# EAGLE design OSO-SAFE-B1-03 (EAGLE 9.4.2)
COMPANY: ADAFRUIT INDUSTRIES; DRAWN: KTOWN; REV: B
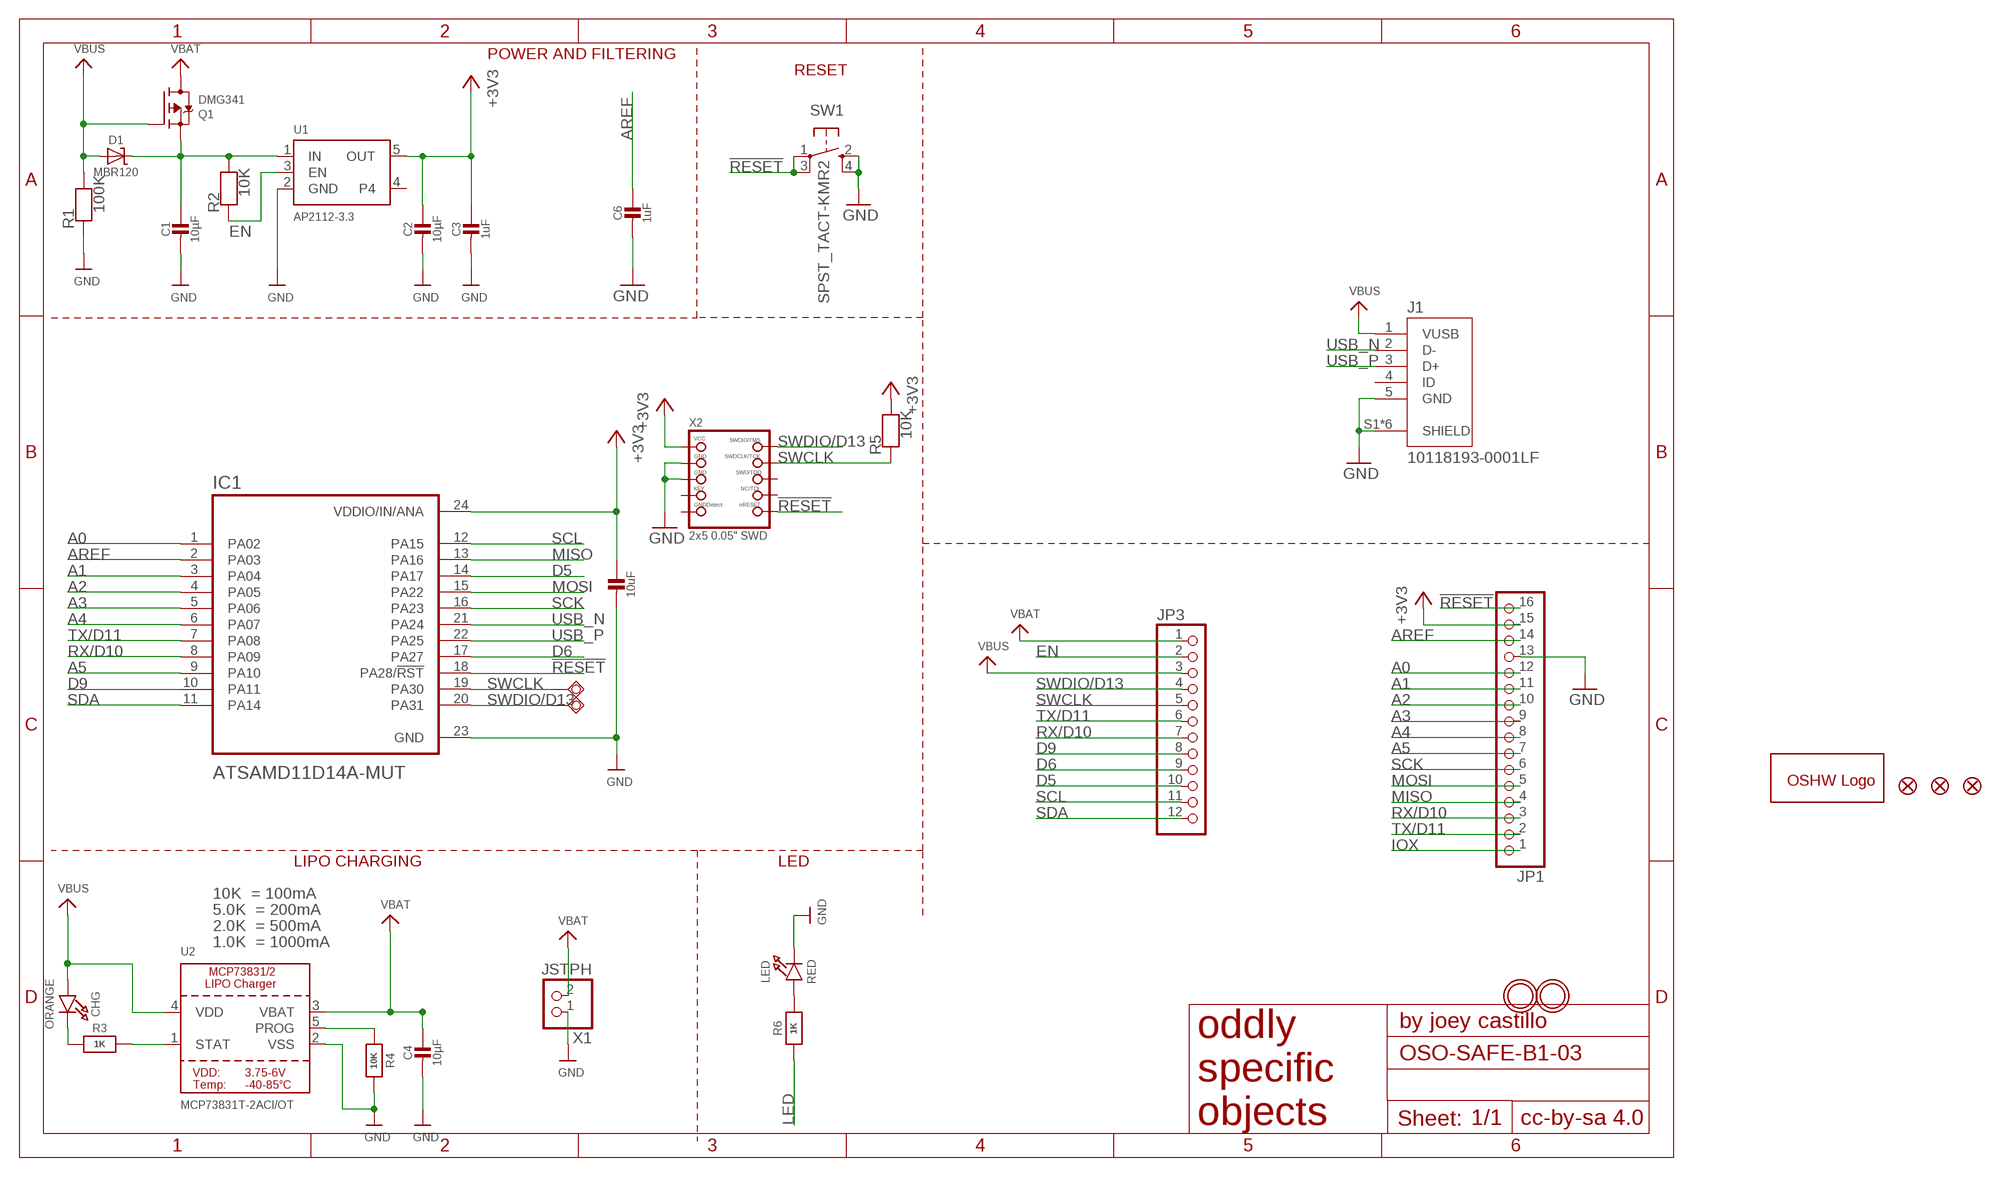
[diagram p0: schematic, sheet 1]

## Parts
C1  10µF  CAP_CERAMIC0805-NOOUTLINE  [0805-NO]
C2  10µF  CAP_CERAMIC0805-NOOUTLINE  [0805-NO]
C3  1uF  CAP_CERAMIC0805-NOOUTLINE  [0805-NO]
C4  10µF  CAP_CERAMIC0805-NOOUTLINE  [0805-NO]
C5  10uF  CAP_CERAMIC0805-NOOUTLINE  [0805-NO]
C6  1uF  CAP_CERAMIC0805-NOOUTLINE  [0805-NO]
CHG  ORANGE  LED0805_NOOUTLINE  [CHIPLED_0805_NOOUTLINE]
D1  MBR120  DIODE-SCHOTTKYSOD-123  [SOD-123]
FID1  FIDUCIAL_1MM  [FIDUCIAL_1MM]
FID3  FIDUCIAL_1MM  [FIDUCIAL_1MM]
FID4  FIDUCIAL_1MM  [FIDUCIAL_1MM]
GOLD_ORB_SM1  OSHWLOGOLOGO5MM  [OSHW_5MM]
IC1  ATSAMD11D14A-MUT  [QFN50P400X400X90-25N]
J1  10118193-0001LF  [FCI_10118193-0001LF]
JP1  HEADER-1X16_MIN  [1X16_ROUND_MIN]
JP3  HEADER-1X12_MIN  [1X12_ROUND_MIN]
LED  RED  LED0805_NOOUTLINE  [CHIPLED_0805_NOOUTLINE]
Q1  DMG341  MOSFET-P  [SOT23-R]
R1  100K  RESISTOR0805_NOOUTLINE  [0805-NO]
R2  10K  RESISTOR0805_NOOUTLINE  [0805-NO]
R3  1K  RESISTOR0805_NOOUTLINE  [0805-NO]
R4  10K  RESISTOR0805_NOOUTLINE  [0805-NO]
R5  10K  RESISTOR0805_NOOUTLINE  [0805-NO]
R6  1K  RESISTOR0805_NOOUTLINE  [0805-NO]
SW1  SPST_TACT-KMR2  [KMR2]
SWCLK  TPSQTP20R  [TP20R]
SWDIO  TPSQTP20R  [TP20R]
U1  AP2112-3.3  VREG_SOT23-5  [SOT23-5]
U2  MCP73831T-2ACI/OT  MCP73831/2  [SOT23-5]
U$31  MOUNTINGHOLE2.5  [MOUNTINGHOLE_2.5_PLATED]
U$32  MOUNTINGHOLE2.5  [MOUNTINGHOLE_2.5_PLATED]
X1  JSTPH  CON_JST_PH_2PIN  [JSTPH2]
X2  2x5 0.05" SWD  JTAG-CORTEXBOXPOSTS  [2X05_1.27MM_BOX_POSTS]

## Nets
!RESET: IC1.18(PA28/!RST) JP1.16 SW1.1(P) SW1.3(P1) X2.10(NRESET)
+3V3 [power]: C2.1 C3.1 C5.1 IC1.24(VDDIO/IN/ANA) JP1.15 R5.2 U1.5(OUT) X2.1(VCC)
A0: IC1.1(PA02) JP1.12
A1: IC1.3(PA04) JP1.11
A2: IC1.4(PA05) JP1.10
A3: IC1.5(PA06) JP1.9
A4: IC1.6(PA07) JP1.8
A5: IC1.9(PA10) JP1.7
AREF: C6.1 IC1.2(PA03) JP1.14
CHG: CHG.C R3.1
D5: IC1.14(PA17) JP3.10
D6: IC1.17(PA27) JP3.9
D9: IC1.10(PA11) JP3.8
EN: JP3.2 R2.1 U1.3(EN)
GND [gnd]: C1.2 C2.2 C3.2 C4.2 C5.2 C6.2 IC1.23(GND) J1.5(GND) J1.S1(SHIELD) J1.S2(SHIELD) J1.S3(SHIELD) J1.S4(SHIELD) J1.S5(SHIELD) J1.S6(SHIELD) JP1.13 LED.C R1.1 R4.2 SW1.2(S) SW1.4(S1) U1.2(GND) U2.2(VSS) X1.1 X2.3(GND) X2.5(GND)
IOX: JP1.1
LED: R6.1
MISO: IC1.13(PA16) JP1.4
MOSI: IC1.15(PA22) JP1.5
N$1: LED.A R6.2
PROG: R4.1 U2.5(PROG)
RX/D10: IC1.8(PA09) JP1.3 JP3.7
SCK: IC1.16(PA23) JP1.6
SCL: IC1.12(PA15) JP3.11
SDA: IC1.11(PA14) JP3.12
STAT: R3.2 U2.1(STAT)
SWCLK: IC1.19(PA30) JP3.5 R5.1 SWCLK.TP X2.4(SWDCLK)
SWDIO/D13: IC1.20(PA31) JP3.4 SWDIO.TP X2.2(SWDIO)
TX/D11: IC1.7(PA08) JP1.2 JP3.6
USB_N: IC1.21(PA24) J1.2(D-)
USB_P: IC1.22(PA25) J1.3(D+)
VBAT [power]: C4.1 JP3.1 Q1.3(D) U2.3(VBAT) X1.2
VBUS [power]: CHG.A D1.A J1.1(VUSB) JP3.3 Q1.1(G) R1.2 U2.4(VDD)
VHI [power]: C1.1 D1.C Q1.2(S) R2.2 U1.1(IN)
Unconnected: J1.4(ID) U1.4 X2.6(SWO) X2.7(KEY) X2.8(TDI) X2.9(GNDDETECT)

## Notes on the sheet
- POWER AND FILTERING
- RESET
- LIPO CHARGING | LED
- 10K  = 100mA
- 5.0K  = 200mA
- 2.0K  = 500mA
- 1.0K  = 1000mA

## Library data of the parts
C1-C6 = microbuilder:CAP_CERAMIC: Ceramic Capacitors For new designs, use the packages preceded by an '_' character since they are more reliable: The following footprints should be used on most boards: _0402 - Standard footprint for regular board layouts _0603 - Standard footprint for regular board layouts _0805 - Standard footprint for regular board layouts _1206 - Standard footprint for regular board layouts For extremely tight-pitch boards where space is at a premium, the following 'micro-pitch' footprints can be used (smaller pads, no silkscreen outline, etc.): _0402MP - Micro-pitch footprint for very dense/compact boards _0603MP - Micro-pitch footprint for very dense/compact boards _0805MP - Micro-pitch footprint for very dense/compact boards _1206MP - Micro-pitch footprint for very dense/compact boards
CHG LED = microbuilder:LED: LED 0603 - 0603 Surface Mount Package 2mA: Green LED - Low Power (3.9mcd, 2ma, 1.7Vf) - Digikey: 475-2709-2-ND Orange LED - Low Power (9.8mcd, 2ma, 1.8Vf) - Digikey: 475-1194-2-ND Red LED - Low Power (5mcd, 2ma, 1.8Vf) - Digikey: 475-1195-2-ND Yellow LED - Low Power (7mcd, 2ma, 1.8Vf) - Digikey: 475-1196-2-ND 5mA: Blue LED - Low Power (17mcd, 5ma, 2.9Vf) - Digikey: LNJ937W8CRACT-ND 0805 - 0805 Surface Mount Package 2mA: Red LED (8.8mcd, 2mA, 1.8Vf, Clear) - Low Power [Digikey: 475-2510-1-ND] Green LED (5mcd, 2mA, 1.8Vf, Clear) - Low Power [Digikey: 475-2730-1-ND] Yellow LED (11.3mcd, 2mA, 1.8Vf, Clear) - Low Power [Digikey: 475-2555-1-ND] 20mA: Red LED (104mcd, 20mA, Diffused) - LS R976 [Digikey: 475-1278-6-ND] Red LED (12mcd, 20mA, 2.0Vf, Clear) - APT2012EC [Digikey: 754-1128-1-ND] Green LED (15mcd, 20mA, 2.2Vf, Clear) - APT2012GC [Digikey: 754-1131-1-ND] Orange LED (160mcd, 20mA, 2.1Vf, Clear) - APT2012SECK [Digikey: 754-1130-1-ND] 1206 - 1206 Surface Mount Package Green LED (26mcd, 20mA, Diffused) - LG N971 [Digikey: 475-1407-6-ND] Red LED (15mcd, 20mA, Diffused) - LH N974 [Digikey: 475-1416-6-ND] Cree - Cree High-Power Surface Mount LEDs XPEBWT-L1-0000-00D50 - White 111lm 350mA 2.9Vf 6200K 110° XTEAWT-00-0000-00000LEE3 - White 114lm 350mA 2.85Vf 5000K 115° Everlight - Everlight 45-21 Series Surface Mount LEDs 45-21/QK2C-B2832AC2CB2/2T - Warm White 2000mcd 20mA 3.25Vf 3050K 120° 45-21/LK2C-B38452C4CB2/2T - Nuetral White 2000mcd 20mA 3.25Vf 4150K 120° 45-21/LK2C-B50634C6CB2/2T - Cold White 2200mcd 20mA 3.25Vf 5650K 120° PLCC2 Reverse Mount LS T77K-J1L2-1-0-2-R18-Z - Red 11.25mcd 2mA 1.8Vf 630nm 120° LO T77K-L1M2-24-Z - Orange 19.6mcd 2mA 1.8Vf 606nm 120° LY T77K-K2M1-26-Z - Yellow 15.7mcd 2mA 1.8Vf 587nm 120°
D1 = microbuilder:DIODE-SCHOTTKY
FID1 FID3 FID4 = microbuilder:FIDUCIAL: Fiducial Alignment Points Various fiducial points for machine vision alignment.; BOM: EXCLUDE
GOLD_ORB_SM1 = oshw:OSHWLOGO: The OSHW logo for PCB layout
IC1 = ATSAMD11D14A-MUT:ATSAMD11D14A-MUT: None; AVAILABILITY: Unavailable; DESCRIPTION: Cortex-M0+, 16KB FLASH, 4KB SRAM, USB - 24 QFN, INDUSTRIAL, GREEN, 1.6-3.6V, 48MHz/ QFN _ZA_; MF: Microchip; MP: ATSAMD11D14A-MUT; PACKAGE: QFN-24 Microchip; PRICE: None
J1 = 10118193-0001LF:10118193-0001LF: Micro USB B Type Receptacle; DESCRIPTION: Single Port 5 Contact Shielded SMT MICRO USB B-Type Receptacle; DIGI-KEY_PART_NUMBER: 609-4616-1-ND; DIGI-KEY_PURCHASE_URL: https://www.digikey.com/product-detail/en/amphenol-icc-fci/10118193-0001LF/609-4616-1-ND/2785380?utm_source=snapeda&utm_medium=aggregator&utm_campaign=symbol; MF: Amphenol ICC; MP: 10118193-0001LF; PACKAGE: None
JP1 = microbuilder:HEADER-1X16: PIN HEADER
JP3 = microbuilder:HEADER-1X12
Q1 = microbuilder:MOSFET-P: P-Channel Mosfet LEGEND VDS: Voltage Drain-Source ID: Drain Current RDS(ON): Drain-Source On-State Resistance VGS(TH): Gate-Source Threshold Voltage CISS: Drain-Source Input Capacitance SOT-23 Name VDS ID RDS(ON) VGS(TH) CISS Order Number IRLML5103 30V 760mA 600 mOhm -- 75pF @ 25V Digikey: IRLML5103PBFCT-ND IRLML6401 12V 4.3A 50 mOhm 950mV @ 250µA 830pF @ 10V Digikey: IRLML6401PBFTR-ND NTR0202PL 20V 400mA 800 mOhm 2.3V @ 250uA 70pF @ 5V Digikey: NTR0202PLT1GOSTR-ND NTR4101PT1G 20V 1.8A 85 mOhm 1.2V @ 250uA 675pF @ 10V Digikey: NTR4101PT1GOSCT-ND DMP2004K 20V 600mA 900 mOhm 1V @ 250uA 175pF @ 16V Digikey: DMP2004KDICT-ND PMV65XP 20V 3.9A 76 mOhm 950mV @ 1mA 725pF @ 20V Digikey: 568-2358-2-ND TO-252 Name VDS ID RDS(ON) VGS(TH) CISS Order Number AOD417 30V 25A 34 mOhm 3V @ 250µA 920pF @ 15V Digikey: 785-1106-2-ND PowerPak Name VDS ID RDS(ON) VGS(TH) CISS Order Number AON7401 30V 12A 14 mOhm 3V @ 250µA 2600pF @ 15V Digikey: 785-1302-1-ND
R1-R6 = microbuilder:RESISTOR: Resistors For new designs, use the packages preceded by an '_' character since they are more reliable: The following footprints should be used on most boards: _0402 - Standard footprint for regular board layouts _0603 - Standard footprint for regular board layouts _0805 - Standard footprint for regular board layouts _1206 - Standard footprint for regular board layouts For extremely tight-pitch boards where space is at a premium, the following 'micro-pitch' footprints can be used (smaller pads, no silkscreen outline, etc.): _0402MP - Micro-pitch footprint for very dense/compact boards _0603MP - Micro-pitch footprint for very dense/compact boards _0805MP - Micro-pitch footprint for very dense/compact boards _1206MP - Micro-pitch footprint for very dense/compact boards
SW1 = adafruit:SPST_TACT: SMT 6mm switch, EVQQ2 series http://www.ladyada.net/library/eagle
SWCLK SWDIO = testpad:TPSQ: Test pad
U1 = microbuilder:VREG_SOT23-5: SOT23-5 Fixed Voltage Regulators Part Current Out V Out V In V Dropout θJA (°C/W) TJ (°C) Digikey Part No. ADP121 150mA 3.3V 3.4-5.5V 0.09V @ 150mA -- -- ADP121-AUJZ33R7CT-ND ADP121 150mA 3.0V 3.1-5.5V 0.09V @ 150mA -- -- ADP121-AUJZ30R7CT-ND ADP122 300mA 3.3V 3.4-5.5V 0.085V @ 300mA -- -- ADP122AUJZ-3.3-R7CT-ND ADP1712 300mA 3.3V 3.5-5.5V 0.17V @ 300mA -- -- ADP1712AUJZ-3.3-R7TR-ND AP7311 (Low Cost) 150mA 3.3V 3.5-6V 0.15V @ 150mA -- -- AP7311-33WG-7DICT-ND LD39015M18R 150mA 1.8V 1.9V-5.5V 0.08V @ 100mA -- -- 497-6977-1-ND LP2985A-33DBVR 150mA 3.3V 3.3-16V 0.28V @ 150mA 206 150 296-18479-1-ND MCP1824T-3302E/OT 300mA 3.3V 3.5V-6V 0.2V @ 300mA -- -- MCP1824T-3302E/OTCT-ND MIC5205-2.5YM5 TR 150mA 2.5V 2.7-16V 0.165V @ 150mA -- -- 576-1257-2-ND MIC5205-3.0YM5 TR 150mA 3.0V 3.2V-16V 0.165V @ 150mA -- -- 576-1258-2-ND MIC5205-3.3YM5 TR 150mA 3.3V 3.5V-16V 0.165V @ 150mA -- -- 576-1259-2-ND TPS780330220 150mA 3.3V+2.2V 3.6-5.5V 250mV Max -- -- 296-23332-1-ND TDA3663/N1,135 100mA 3.3V 3.5-45V 0.18V @ 50mA -- -- 568-5343-1-ND Max operating temp can be calculated using θJA, TJ (max junction temperature), and power in watts. Set the "Maximum Ambient Temperature" until it reaches TJ ("Max Junction Temperature"), which is the absolute limit for safe use of the regulator: Heat Sink Temperature Calculator <http://www.daycounter.com/Calculators/Heat-Sink-Temperature-Calculator.phtml> For example, With 12V source into a 3.3V LP2985 and a 30mA load, we are dissipating (12V-3.3V) * 0.03A = 0.261W. With a θJA of 206 °C/W, a TJ of 150°C, and 261mW we can safely use the chip without a heat sink up to 75°C (=147.1°C Junction Temperature).
U2 = microbuilder:MCP73831/2: MCP73831/2 LIPO Charger VDD: 3.75 - 6V Temp -40 - 85°C Programmable Charge Rate: 15-500mA NOTE: STAT is a tri-state logic output on the MCP73831 and an open-drain output on the MCP73832. SOT23-5 with 4.2V output and tri-state logic on STAT = MCP73831T-2ACI/OT
U$31 U$32 = microbuilder:MOUNTINGHOLE: Mounting Hole For #2 screws (0.086"/2.18mm width, 0.094"/2.4mm hole) use 2.5mm; BOM: EXCLUDE
X1 = microbuilder:CON_JST_PH_2PIN: JST 2-Pin Right-Angle Connector PH-Series - 4UConnector: 17311 SH-Series - 4UConnector: 07278
X2 = microbuilder:JTAG-CORTEX: Serial Wire (SW-DP) Connector Standard 0.05" 10-pin connector is for use with the Cortex M and Cortex A SWD (serial wire debugger) interface (SW-DP) Connectors 2x05_1.27MM_SMT - Inexpensive surface-mount header with bare pins, compatible with standard 10-pin SWD cables (4UCON: 16846) 2x05_1.27MM_BOX_NOPOSTS - Polarised surface-mount box (4UCON with caps: 19735, without caps: 15117 2x05_1.27MM_BOX_POSTS - Polarised surface-mount box with mounting holes (4UCON: 20317) Pinout: http://infocenter.arm.com/help/topic/com.arm.doc.faqs/attached/13634/cortex_debug_connectors.pdf http://www.keil.com/peripherals/coresight/connectors.asp

## Net classes
0 default: width 0.254 mm, drill 0.254 mm
1 power: width 0.305 mm, drill 0.305 mm
2 gnd: width 0.254 mm, drill 0.254 mm

## Board
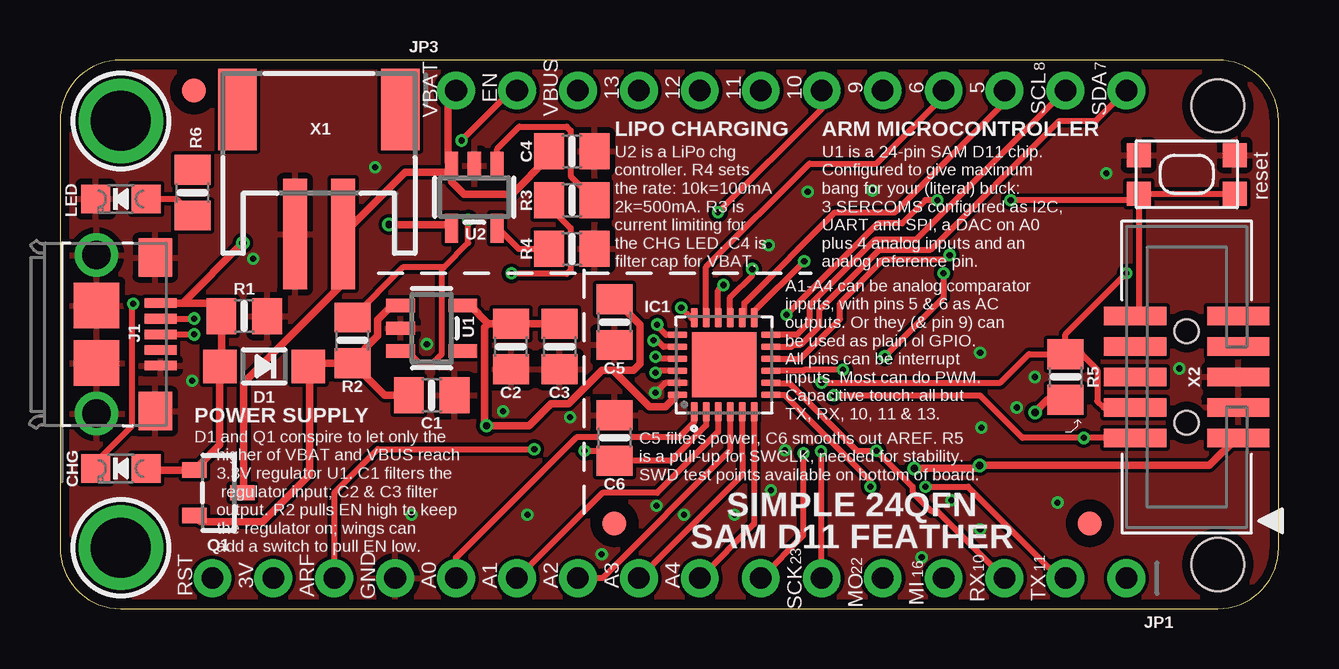
[diagram p1: board, top side]
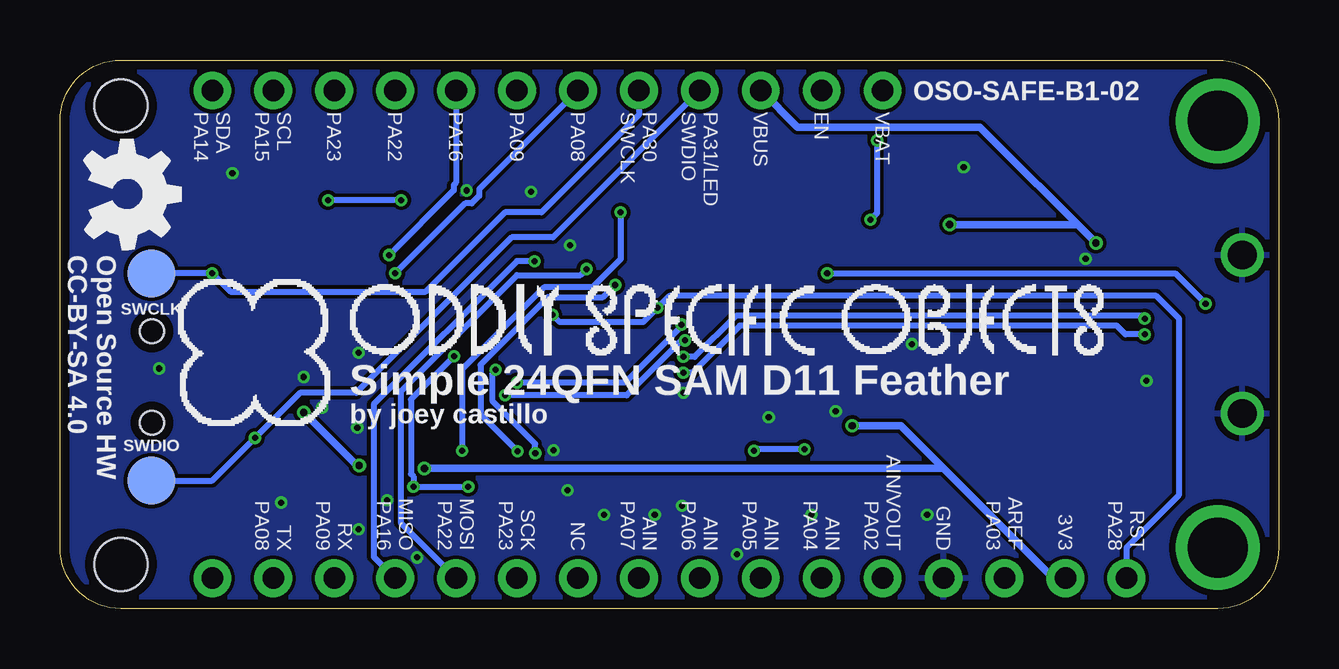
[diagram p2: board, bottom side, seen from below]

Size 50.8 x 22.86 mm. Coordinates in mm from the lower left corner, seen from the top.
Outline: 2.54,0 48.26,0 arc90 50.8,2.54 50.8,20.32 arc90 48.26,22.86 2.54,22.86 arc90 0,20.32 0,2.54 arc90 2.54,0
Copper layers (1*16): Top 0.035559375mm / dielectric 1.6mm / Bottom 0.035559375mm
Design rules "oshpark-2layer *": minimum track width 6mil, minimum drill 10mil, track to track 6mil, track to pad 6mil, pad to pad 6mil, via to via 6mil, smd to smd 6mil, copper to edge 15mil, drill to drill 6mil, minimum pad ring 5mil, minimum via ring 5mil, stop-mask expansion 2.5mil, vias tented up to drill 12mil, thermal gap 10mil
Holes 2.2 mm at 48.26,1.84 48.26,20.95

### Footprints (pad centres in the part's own frame; a part is rotated, then mirrored left to right if it is on the bottom)
0805-NO = smd 1.24 x 1.5: 1 -0.95,0; 2 0.95,0
CHIPLED_0805_NOOUTLINE = smd 1.2 x 1.2: A 0,-1.05; C 0,1.05
SOD-123 = smd 1.4 x 1.4: A 1.85,0; C -1.85,0
FIDUCIAL_1MM = smd 1 x 1: 1 0,0
QFN50P400X400X90-25N = smd 0.81 x 0.27: 1 -1.955,1.25; 2 -1.955,0.75; 3 -1.955,0.25; 4 -1.955,-0.25; 5 -1.955,-0.75; 6 -1.955,-1.25; 13 1.955,-1.25; 14 1.955,-0.75; 15 1.955,-0.25; 16 1.955,0.25; 17 1.955,0.75; 18 1.955,1.25 | smd 0.27 x 0.81: 7 -1.25,-1.955; 8 -0.75,-1.955; 9 -0.25,-1.955; 10 0.25,-1.955; 11 0.75,-1.955; 12 1.25,-1.955; 19 1.25,1.955; 20 0.75,1.955; 21 0.25,1.955; 22 -0.25,1.955; 23 -0.75,1.955; 24 -1.25,1.955 | smd 2.7 x 2.7: 25 0,0
FCI_10118193-0001LF = smd 0.4 x 1.35: 1 -1.3,2.675; 2 -0.65,2.675; 3 0,2.675; 4 0.65,2.675; 5 1.3,2.675 | smd 1.6 x 1.4: S1 -3.2,2.45; S2 3.2,2.45 | smd 1.9 x 1.9: S3 1.2,0; S4 -1.2,0 | drill 1.2: S5 3.302,0; S6 -3.302,0
1X16_ROUND_MIN = drill 0.9 pad 1.575: 1 -19.05,0; 2 -16.51,0; 3 -13.97,0; 4 -11.43,0; 5 -8.89,0; 6 -6.35,0; 7 -3.81,0; 8 -1.27,0; 9 1.27,0; 10 3.81,0; 11 6.35,0; 12 8.89,0; 13 11.43,0; 14 13.97,0; 15 16.51,0; 16 19.05,0
1X12_ROUND_MIN = drill 0.9 pad 1.575: 1 -13.97,0; 2 -11.43,0; 3 -8.89,0; 4 -6.35,0; 5 -3.81,0; 6 -1.27,0; 7 1.27,0; 8 3.81,0; 9 6.35,0; 10 8.89,0; 11 11.43,0; 12 13.97,0
SOT23-R = smd 0.635 x 1.016: 1 -0.95,-1; 2 0.95,-1; 3 0,1
KMR2 = smd 1 x 1: 1 2,0.8; 2 2,-0.8; 3 -2,0.8; 4 -2,-0.8
TP20R = smd 2 x 2: TP 0,0
SOT23-5 = smd 0.55 x 1.2: 1 -0.95,-1.3; 2 0,-1.3; 3 0.95,-1.3; 4 0.95,1.3; 5 -0.95,1.3
MOUNTINGHOLE_2.5_PLATED = drill 2.5 pad 3.2: P$1 0,0
JSTPH2 = smd 1 x 4.6: 1 -1,-3.7; 2 1,-3.7 | smd 1.6 x 3.4: NC1 -3.4,1.5; NC2 3.4,1.5
2X05_1.27MM_BOX_POSTS = smd 0.76 x 2.6: 1 -2.54,-2.15; 2 -2.54,2.15; 3 -1.27,-2.15; 4 -1.27,2.15; 5 0,-2.15; 6 0,2.15; 7 1.27,-2.15; 8 1.27,2.15; 9 2.54,-2.15; 10 2.54,2.15 | hole 1: -1.905,0; 1.905,0

### Placement (x,y rotation side)
C1  15.49,8.89 0 top
C2  18.8,10.92 270 top
C3  20.83,10.92 270 top
C4  21.34,19.05 0 top
C5  23.11,11.94 270 top
C6  23.11,7.11 90 top
CHG  2.54,5.84 90 top
D1  8.51,10.1 180 top
FID1  42.93,3.56 0 top
FID3  5.59,21.59 0 top
FID4  23.11,3.56 0 top
GOLD_ORB_SM1  48.01,17.27 270 bottom
IC1  27.69,10.16 90 top
J1  1.52,11.43 270 top
JP1  25.4,1.27 180 top
JP3  30.48,21.59 0 top
LED  2.54,17.07 90 top
Q1  6.6,4.83 270 top
R1  7.68,12.19 180 top
R2  12.19,11.18 270 top
R3  21.34,17.02 0 top
R4  21.34,14.99 0 top
R5  41.91,9.65 270 top
R6  5.52,17.34 270 top
SW1  46.96,18.1 180 top
SWCLK  46.99,13.97 0 bottom
SWDIO  46.99,5.33 0 bottom
U1  15.49,11.68 270 top
U2  17.27,17.14 180 top
U$2  OSO_BEAR  [OSO_BEAR_750MIL]  9.07,-15.54 0 bottom  (outside the outline)
U$3  OSO_GRAPHIC  [OSO_GRAPHIC]  42.7,10.67 0 bottom
U$5  OSO_TEXTOSO_TEXT_ONELINE_125MIL  [OSO_ONELINE_125MIL]  38.73,12.04 0 bottom
U$31  2.54,20.32 270 top
U$32  2.54,2.54 270 top
X1  10.79,19.3 0 top
X2  46.96,9.65 90 top

### Tracks (layer width: path | path; a pad name or v marks a point on that pad's centre or on a via)
!RESET  (via drill 0.25)
  Top 0.254: v36.58,17.02 36.07,17.02 35.1,16.05 34.09,16.05 v30.28,12.24 | SW1.1 44.97,17.28 44.7,17.02 v39.62,17.02 | X2.10 44.98,12.36 44.98,17.28 SW1.1 | SW1.1 SW1.3 | IC1.18 26.32,12.12 v25.89,12.54
  Bottom 0.254: JP1.16 6.35,2.54 4.17,4.71 4.17,12.1 5.11,13.03 25.4,13.03 v25.89,12.54 26.49,11.94 29.97,11.94 v30.28,12.24 | v36.58,17.02 v39.62,17.02
+3V3  (via drill 0.3)
  Top 0.305: U1.5 17.08,12.63 17.85,11.87 | 17.85,11.87 C2.1 C3.1 | 17.85,11.87 17.7,11.72 17.7,7.7 v17.78,7.62 19.56,7.62 20.48,8.54 21.2,8.54 22.6,9.94 23.05,9.94 | X2.1 49.08,7.11 47.9,5.97 v38.33,5.97 38.2,5.84 v35.61,5.84 | 23.05,9.94 24.58,8.41 25.23,8.41 IC1.24 | C5.1 24.17,11.83 24.17,10.2 23.91,9.94 23.05,9.94 | R5.2 41.16,8.7 v40.64,8.18
  Bottom 0.305: v35.61,5.84 13.97,5.84 | JP1.15 9.4,1.27 13.97,5.84 | v17.78,7.62 15.75,7.62 13.97,5.84 | v40.64,8.18 38.43,5.97 v38.33,5.97
A0
  Top 0.254: JP1.12 16.51,2.12 21.53,7.14 25.8,7.14 26.44,7.77 IC1.1
A1
  Top 0.254: IC1.3 27.44,7.37 24.89,4.83 22.61,4.83 JP1.11
A2
  Top 0.254: IC1.4 27.94,6.6 22.61,1.27 JP1.10
A3
  Top 0.254: IC1.5 28.44,6.36 28.45,6.35 28.45,5.59 JP1.9
A4
  Top 0.254: IC1.6 28.94,3.54 JP1.8
A5  (via drill 0.25)
  Top 0.254: JP1.7 30.99,3.05 v30.99,6.48 | v32.64,9.95 31.02,9.95 30.98,9.91 IC1.9
  Bottom 0.254: v32.64,9.95 32.79,9.8 32.79,8.66 30.99,6.87 v30.99,6.48
AREF  (via drill 0.25)
  Top 0.254: IC1.2 26.94,7.63 25.47,6.16 C6.1 22.7,6.58 v21.87,6.58 | JP1.14 11.43,4.83 13.25,6.64 v19.77,6.64
  Bottom 0.254: v19.77,6.64 21.8,6.64 v21.87,6.58
CHG  (via drill 0.25)
  Top 0.254: R3.1 20.39,16.75 21.29,15.85 21.29,14.1 21.13,13.95 18.85,13.95 v18.82,13.97 | v3.05,12.7 3,12.65 3,7.6 1.49,6.1 CHG.C
  Bottom 0.254: v18.82,13.97 4.32,13.97 v3.05,12.7
D5
  Top 0.254: IC1.14 28.52,12.2 28.52,12.73 32.3,16.51 34.8,16.51 39.37,21.08 JP3.10
D6
  Top 0.254: IC1.17 26.94,14.24 31.24,18.54 34.04,18.54 36.83,21.34 JP3.9
D9  (via drill 0.25)
  Top 0.254: IC1.10 30.86,10.41 32.51,12.06 32.51,12.73 34.33,14.55 36.91,14.55 v37.08,14.73
  Bottom 0.254: v37.08,14.73 34.39,17.42 34.39,17.64 34.29,17.75 JP3.8
EN  (via drill 0.25)
  Top 0.254: R2.1 14.29,14.22 16,14.22 | 16,14.22 17.02,15.24 v17.02,16.2 | 16,14.22 15.91,14.13 15.91,10.61 15.55,10.25 14.98,10.25 14.5,10.73 U1.3 | JP3.2 18.82,21.59 v16.74,19.51
  Bottom 0.254: v16.74,19.51 16.74,16.48 v17.02,16.2
GND  (via drill 0.25)
  Top 0.254: IC1.23 25.23,9.41 v24.82,8.99
  other vias: 30.23,6.6 21.26,7.98 18.47,8.23 5.51,9.5 8.05,14.58 46.66,10.01 41.58,4.42 38.35,3.3 38.35,10.67 14.66,3.91 29.64,4.93 15.29,11.02 13.13,18.39 31.17,17.37 38.4,7.54 19.48,3.91 24.87,4.29 26.01,3.91 28.12,3.91 22.58,2.26 35.92,2.13 33.86,17.42 29.54,15.14 43.61,18.14 37.16,4.52 40.64,9.65 39.88,8.38
  pour Top: -0.25,22.86 -0.25,0 50.93,0 50.93,22.86
  pour Bottom: 0,0 51.18,0 51.18,22.86 0,22.86
MISO  (via drill 0.25)
  Top 0.254: IC1.13 28.94,12.39 v31.02,14.48
  Bottom 0.254: JP1.4 37.72,2.16 37.72,8.51 31.75,14.48 v31.02,14.48
MOSI  (via drill 0.25)
  Top 0.254: IC1.15 27.94,12.97 28.85,13.89 v28.85,14.15
  Bottom 0.254: v28.85,14.15 29.11,13.89 31.75,13.89 36.6,9.04 36.6,3.58 JP1.5
N$1
  Top 0.254: LED.A 4.84,17.07 R6.2
PROG
  Top 0.254: U2.5 18.26,15.85 19.12,14.99 R4.1
RX/D10  (via drill 0.25)
  Top 0.254: IC1.8 29.65,9.4 30.4,9.4 33.24,6.57 34.02,6.57 v34.04,6.58 35.53,5.08 35.53,4.86 36.33,4.06 36.58,4.06 JP1.3 | JP3.7 31.75,20.83 v27.43,16.51
  Bottom 0.254: v27.43,16.51 27.43,14.56 28.61,13.38 30.63,13.38 34.04,9.97 v34.04,6.58
SCK  (via drill 0.25)
  Top 0.254: v31.73,6.55 31.73,1.29 JP1.6 | IC1.16 27.44,13.26 v27.66,13.48
  Bottom 0.254: v31.73,6.55 33.27,8.1 33.27,10.16 30.46,12.98 28.16,12.98 v27.66,13.48
SCL
  Top 0.254: JP3.11 35.69,15.37 33.98,15.37 31.24,12.63 31.24,11.94 30.71,11.41 IC1.12
SDA
  Top 0.254: IC1.11 30.48,10.91 30.57,11 30.88,11 31.65,11.77 31.65,12.45 34.16,14.96 36.3,14.96 41.66,20.32 43.18,20.32 JP3.12
STAT
  Top 0.254: R3.2 21.29,18.02 21.29,19.92 21.12,20.08 19.14,20.08 18.22,19.16 U2.1
SWCLK  (via drill 0.25)
  Top 0.254: R5.1 40.39,10.6 39.2,9.42 v31.75,9.42 | R5.1 42.59,10.6 43.23,9.96 43.23,8.65 43.5,8.38 X2.4 | R5.1 41.91,11.43 v44.45,13.97 | IC1.19 25.26,11.41 24.89,11.78 v24.89,11.84
  Bottom 0.254: SWCLK.TP v44.45,13.97 43.69,13.21 35.56,13.21 32.26,16.51 30.73,16.51 26.67,20.57 JP3.5 | v24.89,11.84 24.89,11.76 24.94,11.71 24.96,11.71 27.25,9.42 v31.75,9.42
SWDIO/D13  (via drill 0.25)
  Top 0.254: X2.2 v42.67,7.11 40.12,7.11 38.35,8.89 v32.25,8.89 | IC1.20 25.16,10.91 24.89,11.18 v24.74,11.18
  Bottom 0.254: v24.74,11.18 24.89,11.18 27.18,8.89 v32.25,8.89 | SWDIO.TP 44.45,5.33 v42.67,7.11 40.79,8.99 38.45,8.99 31.97,15.46 30.26,15.46 JP3.4
TX/D11  (via drill 0.25)
  Top 0.254: IC1.7 30.21,8.91 33.78,5.33 v33.78,5.08 | v36.07,5.08 37.85,5.08 41.66,1.27 JP1.2 | v36.83,13.97 36.83,12.96 v34.38,10.51
  Bottom 0.254: v33.78,5.08 v36.07,5.08 36.07,5.51 36.17,5.61 36.17,8.72 v34.38,10.51 | JP3.6 33.33,17.48 33.33,17.2 33.64,16.89 33.91,16.89 v36.83,13.97
USB_N  (via drill 0.25)
  Top 0.254: IC1.21 24.82,10.41 v24.82,10.49 | J1.2 v5.58,12.08 v5.59,12.09
  Bottom 0.254: v24.82,10.49 24.34,10.49 22.63,12.2 5.71,12.2 v5.59,12.09
USB_P  (via drill 0.25)
  Top 0.254: IC1.22 24.82,9.91 v24.82,9.83 | J1.3 v5.58,11.43 v5.59,11.43
  Bottom 0.254: v24.82,9.83 24.43,9.83 22.46,11.8 6.76,11.8 6.38,11.43 v5.59,11.43
VBAT
  Top 0.305: U2.3 16.07,18.19 14.38,18.19 X1.2 11.79,13.55 7.66,9.42 7.66,4.89 Q1.3 | U2.3 16.17,18.6 16.17,21.25 JP3.1 | U2.3 16.32,17.79 16.84,17.27 18.84,17.27 20.39,18.82 C4.1
VBUS  (via drill 0.3)
  Top 0.305: 5.11,12.73 6.2,12.73 R1.2 6.73,10.17 D1.A 6.66,6.83 Q1.1 3.66,5.78 CHG.A | 5.11,12.73 J1.1 | U2.4 16.16,16 v13.72,16 | v7.62,15.24 5.11,12.73
  Bottom 0.305: JP3.3 20.07,20.07 12.45,20.07 v7.62,15.24 8.38,16 v13.72,16
VHI
  Top 0.305: C1.1 13.53,8.89 R2.2 | R2.2 10.49,10.23 D1.C 10.41,10.04 10.41,5.59 8.45,3.62 5.86,3.62 Q1.2 | U1.1 14.08,12.52 13.72,12.52 13.25,12.04 13.25,11.37 12.19,10.31 R2.2

### Text on the board
tPlace: 8 | 7 | VBAT | EN | VBUS | 13 | 12 | 11 | 10 | 9 | 6 | 5 | SCL | SDA | LIPO CHARGING | ARM MICROCONTROLLER | U2 is a LiPo chg / controller. R4 sets / the rate: 10k=100mA / 2k=500mA. R3 is / current limiting for / the CHG LED. C4 is / filter cap for VBAT. | U1 is a 24-pin SAM D11 chip. / Configured to give maximum / bang for your (literal) buck: / 3 SERCOMS configured as I2C, / UART and SPI, a DAC on A0 / plus 4 analog inputs and an / analog reference pin. | reset | A1-A4 can be analog comparator / inputs, with pins 5 & 6 as AC / outputs. Or they (& pin 9) can / be used as plain ol GPIO. / All pins can be interrupt / inputs. Most can do PWM. / Capacitive touch: all but / TX, RX, 10, 11 & 13. | POWER SUPPLY | D1 and Q1 conspire to let only the / higher of VBAT and VBUS reach / 3.3V regulator U1. C1 filters the / regulator input; C2 & C3 filter / output. R2 pulls EN high to keep / the regulator on; wings can / add a switch to pull EN low. | C5 filters power, C6 smooths out AREF. R5 / is a pull-up for SWCLK, needed for stability. / SWD test points available on bottom of board. | SIMPLE 24QFN / SAM D11 FEATHER | 23 | 22 | 16 | 10 | 11 | RST | 3V | ARF | GND | A0 | A1 | A2 | A3 | A4 | SCK | MO | MI | RX | TX
bPlace: ``If you wish to make an apple pie from scratch, / you must first invent the universe.'' / - Carl Sagan | OSO-SAFE-B1-02 | VBAT | EN | VBUS | PA31/LED / SWDIO | PA30 / SWCLK | PA08 | PA09 | PA16 | PA22 | PA23 | SCL / PA15 | SDA / PA14 | Open Source HW / CC-BY-SA 4.0 | Simple 24QFN SAM D11 Feather | by joey castillo | RST / PA28 | 3V3 | AREF / PA03 | GND | AIN/VOUT / PA02 | AIN / PA04 | AIN / PA05 | AIN / PA06 | AIN / PA07 | NC | SCK / PA23 | MOSI / PA22 | MISO / PA16 | RX / PA09 | TX / PA08 | plz don't steal the bear tho.